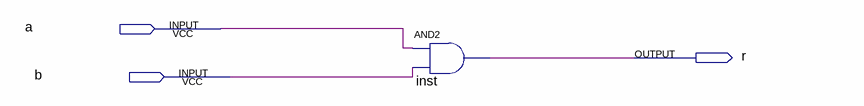
[diagram p0: schematic sheet]
// Quartus schematic andd.bdf as structural Verilog: 1 symbols, 3 pins
module andd (
  input  a,
  input  b,
  output r
);

  and inst (r, a, b);
endmodule
